# Altium project TCS37425_Module.PrjPcb
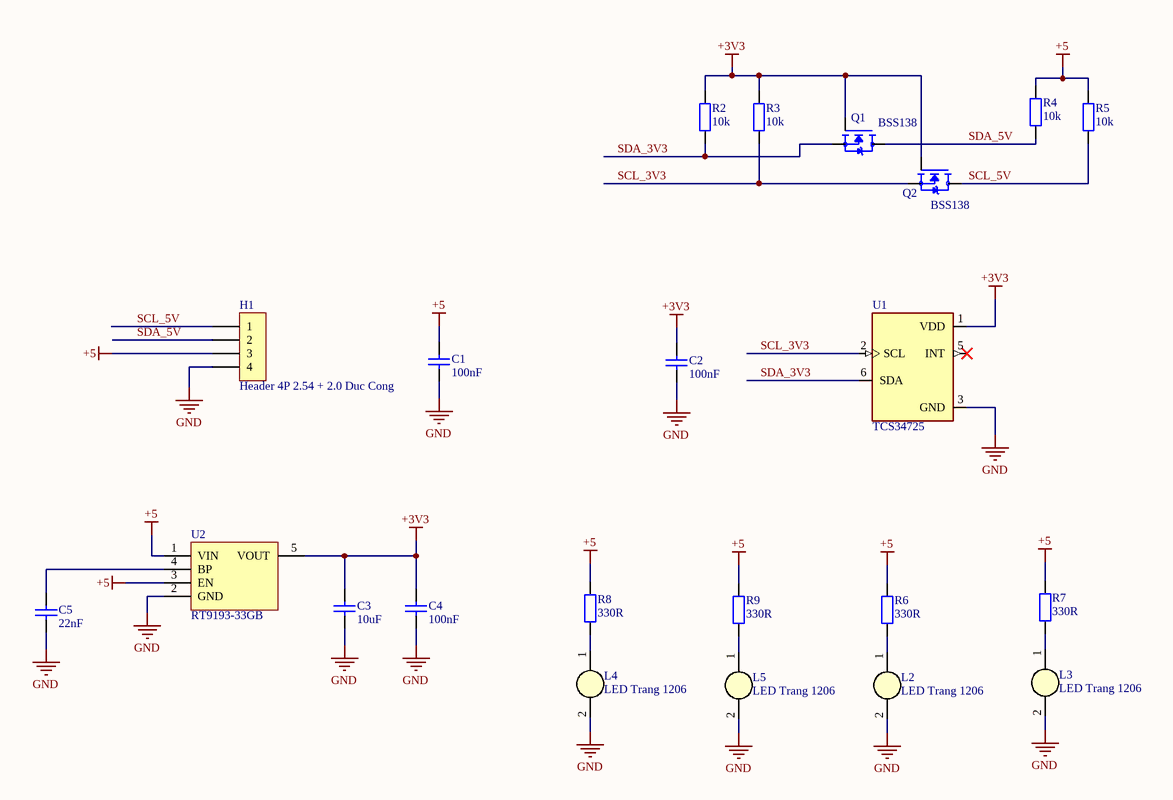
[diagram p0: TCS37425_SCH.SchDoc]
1 sheet, 22 parts. Net scope: global (net labels, ports and power ports of the same name join across sheets).
Board file: TCS34725_PCB.PcbDoc

## Sheet TCS37425_SCH.SchDoc
size A4; SheetNumber: 1; SheetTotal: 1

### Parts
C1  100nF  [tu 0603]
C2  100nF  [tu 0603]
C3  10uF  [tu 0603]
C4  100nF  [tu 0603]
C5  22nF  [tu 0603]
H1  Header 4P 2.54 + 2.0 Duc Cong  [Header 4P DC 2.54 + 2.0]
L2  LED Trang 1206  [LED-1206-Yellow]
L3  LED Trang 1206  [LED-1206-Yellow]
L4  LED Trang 1206  [LED-1206-Yellow]
L5  LED Trang 1206  [LED-1206-Yellow]
Q1  BSS138  [SOT95P240X111-3N]
Q2  BSS138  [SOT95P240X111-3N]
R2  10k  [tro smd 0603]
R3  10k  [tro smd 0603]
R4  10k  [tro smd 0603]
R5  10k  [tro smd 0603]
R6  330R  [tro smd 0603]
R7  330R  [tro smd 0603]
R8  330R  [tro smd 0603]
R9  330R  [tro smd 0603]
U1  TCS34725  [SON65P200X240X70-6N]
U2  RT9193-33GB  [SOT23-5]

### Nets
+3V3: C2.1 C3.1 C4.1 Q1.1(G) Q2.1(G) R2.2 R3.2 U1.1(VDD) U2.5(VOUT)
+5: C1.1 H1.3 R4.2 R5.2 R6.2 R7.2 R8.2 R9.2 U2.1(VIN) U2.3(EN)
GND: C1.2 C2.2 C3.2 C4.2 C5.2 H1.4 L2.2(K) L3.2(K) L4.2(K) L5.2(K) U1.3(GND) U2.2(GND)
SCL_3V3: Q2.2(S) R3.1 U1.2(SCL)
SCL_5V: H1.1 Q2.3(D) R5.1
SDA_3V3: Q1.2(S) R2.1 U1.6(SDA)
SDA_5V: H1.2 Q1.3(D) R4.1
NetC5_1: C5.1 U2.4(BP)
NetL2_1: L2.1(A) R6.1
NetL3_1: L3.1(A) R7.1
NetL4_1: L4.1(A) R8.1
NetL5_1: L5.1(A) R9.1

Not connected (* = marked no-connect by the designer): U1 5(INT)*

### Library data of the parts
C1 C2 C4 C5 = Tu 0603 104 50V 10%: Dán; Don_Vi: Con; So_Chan: 2; Ten_Linh_Kien: Tụ 0603 104-100nF 10% 50V; Ma_Hang: MH004568; Chung_Loai: Dán; Kieu_Chan: *
C3 = Tu 0603 106 16V 20%: Dán; Don_Vi: Con; So_Chan: 2; Ten_Linh_Kien: Tụ 0603-10uF 20% 16V; Ma_Hang: MH004848; Chung_Loai: Dán; Kieu_Chan: *
H1 = Header 4P 2.54 + 2.0 Duc Cong: Cắm; Ten_Linh_Kien: Header 4P XH2.54-4P Đực Cong; Don_Vi: Con; Ma_Hang: MH001310; Chung_Loai: Cắm
L2-L5 = LED 1206 Trang: Dán; Don_Vi: Con; Ma_Hang: MH002332; Ten_Linh_Kien: LED1206 Màu Trắng (White); Ghi_Chu: *; Kieu_Chan: *; Chung_Loai: Dán
Q1 Q2 = BSS138: N-Channel 50 V 220mA (Ta) 350mW (Ta) Surface Mount SOT-23-3; MF: onsemi; SnapEDA_Link: https://www.snapeda.com/parts/BSS138/Onsemi/view-part/?ref=snap; Package: SOT-23-3 ON Semiconductor; Value: *; MP: BSS138; Check_prices: https://www.snapeda.com/parts/BSS138/Onsemi/view-part/?ref=eda
R2-R5 = Tro 0603 1% 10k: Dán; Don_Vi: Con; So_Chan: 2; Ten_Linh_Kien: Trở 0603 1% 10k; Ma_Hang: MH006333; Chung_Loai: Dán; Kieu_Chan: *
R6-R9 = Tro 0603 5% 330R: Dán; Don_Vi: Con; Ma_Hang: MH006910; So_Chan: 2; Ten_Linh_Kien: Trở 0603 5% 330R; Chung_Loai: Dán; Kieu_Chan: *
U1 = TCS34725: MP: TCS34725FN; MF: ams; Price: None; Availability: In Stock; Package: SMD-6 ams; Value: *; SnapEDA_Link: https://www.snapeda.com/parts/TCS34725FN/ams/view-part/?ref=snap; Purchase-URL: https://pricing.snapeda.com/search/part/TCS34725FN/?ref=eda; Check_prices: https://www.snapeda.com/parts/TCS34725FN/ams/view-part/?ref=eda
U2 = REG_5.5V-3.3V-0.3A-1W-SOT-23-5: Linear Voltage Regulator IC 1 Output 300mA SOT-23-5; Manufacturer: Richtek USA Inc.; Alternate Part Number-1: NA; Manufacturer Part Number: RT9193-33GB; Supplier-1: LCSC; Supplier Part Number-1: C15651; Case/Package: SOT-23-5